# EAGLE design moxon_915_passives (EAGLE 9.6.0)
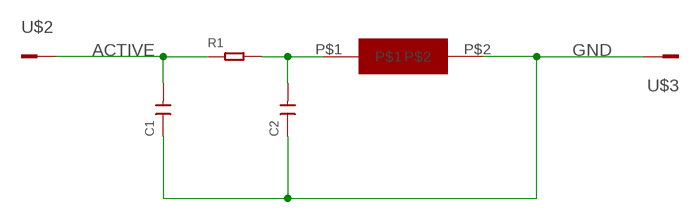
[diagram p0: schematic, sheet 1]

## Parts
C1  1uf  CERAMIC-1UF-25V-10%-X7R(0805)  [C0805]
C2  1uf  CERAMIC-1UF-25V-10%-X7R(0805)  [C0805]
R1  1K  SMD-RES-2.2K-1%-1/8W(0805)  [R0805]
U$1  MOXON-915MOX1  [MOXON-915]
U$2  CONN-1PAD2  [PAD2]
U$3  CONN-1PAD2  [PAD2]

## Nets
ACTIVE: C1.2 R1.1 U$2.P$1
GND: C1.1 C2.1 U$1.P$2 U$3.P$1
N$2: C2.2 R1.2 U$1.P$1

## Library data of the parts
C1 C2 = OPL_Capacitor:CERAMIC-1UF-25V-10%-X7R(0805): 302010179; MPN: CC0805KKX7R8BB105
R1 = OPL_Resistor:SMD-RES-2.2K-1%-1/8W(0805): 301012163; MPN: RC0805JR-071KL
U$1 = wv-antenna:MOXON-915
U$2 U$3 = wv-connector:CONN-1

## Board
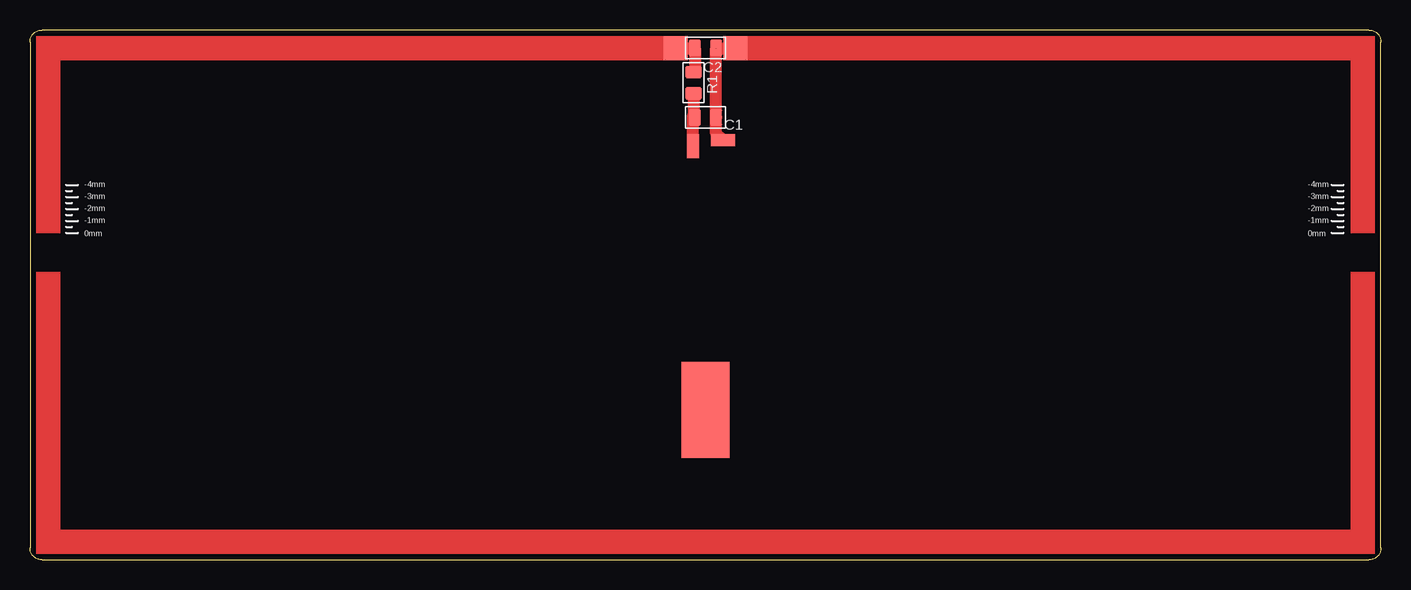
[diagram p1: board, top side]

Size 112.62 x 44.2 mm. Coordinates in mm from the lower left corner, seen from the top.
Outline: 1,0 111.62,0 arc90 112.62,1 112.62,43.2 arc90 111.62,44.2 1,44.2 arc90 0,43.2 0,1 arc90 1,0
Copper layers (1*16): Top 0.035mm / dielectric 1.5mm / Bottom 0.035mm
Design rules "default": minimum track width 6mil, minimum drill 0.35mm, track to track 6mil, track to pad 6mil, pad to pad 6mil, via to via 6mil, smd to smd 6mil, copper to edge 40mil, drill to drill 6mil, minimum pad ring 10mil, minimum via ring 8mil, stop-mask expansion 4mil, vias tented up to drill 0mil, thermal gap 10mil

### Footprints (pad centres in the part's own frame; a part is rotated, then mirrored left to right if it is on the bottom)
C0805 = smd 1.397 x 1.016: 1 0,0.889; 2 0,-0.889
R0805 = smd 1.397 x 1.016: 1 0,0.889; 2 0,-0.889
MOXON-915 = smd 2 x 2: P$1 53.308,42.198; P$2 58.308,42.198 | smd 4 x 8: P$3 55.808,12
PAD2 = smd 2 x 1: P$1 0,0

### Placement (x,y rotation side)
C1  56.31,36.9 270 top
C2  56.31,42.7 270 top
R1  55.31,39.8 180 top
U$1  0.5,0.5 0 top
U$2  55.25,34.5 90 top
U$3  57.75,35 0 top

### Tracks (layer width: path | path; a pad name or v marks a point on that pad's centre or on a via)
ACTIVE
  Top 1: R1.1 55.31,37.01 | 55.31,37.01 C1.2 | U$2.P$1 55.25,36.95 55.31,37.01
GND  (1 unrouted)
  Top 1: C2.1 U$1.P$2 | 57.2,42.68 C1.1 57.2,35.55 U$3.P$1
  Top 1.5: U$1.P$2
N$2
  Top 1: U$1.P$1 C2.2 55.42,40.8 R1.2